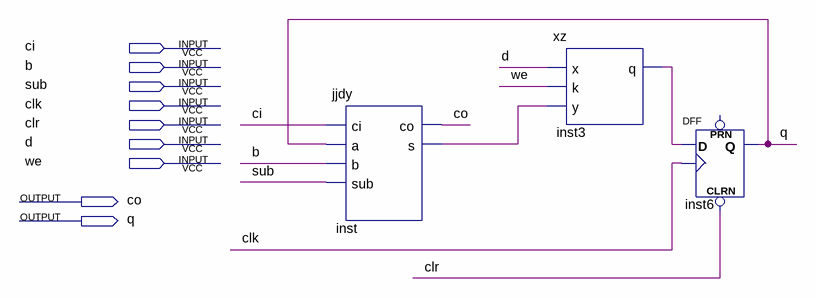
[diagram p0: schematic sheet]
// Quartus schematic jcqdy.bdf as structural Verilog: 3 symbols, 9 pins
module jcqdy (
  input  ci,
  input  b,
  input  sub,
  input  clk,
  input  clr,
  input  d,
  input  we,
  output co,
  output q
);

  wire inst3_q, inst_s;

  jjdy inst (.ci(ci), .a(q), .b(b), .sub(sub), .co(co), .s(inst_s));
  xz inst3 (.x(d), .k(we), .y(inst_s), .q(inst3_q));
  DFF inst6 (.CLRN(clr), .CLK(clk), .D(inst3_q), .Q(q));  // open: PRN
endmodule
